# EAGLE schematic xmax_neopixel (EAGLE 9.2.0)
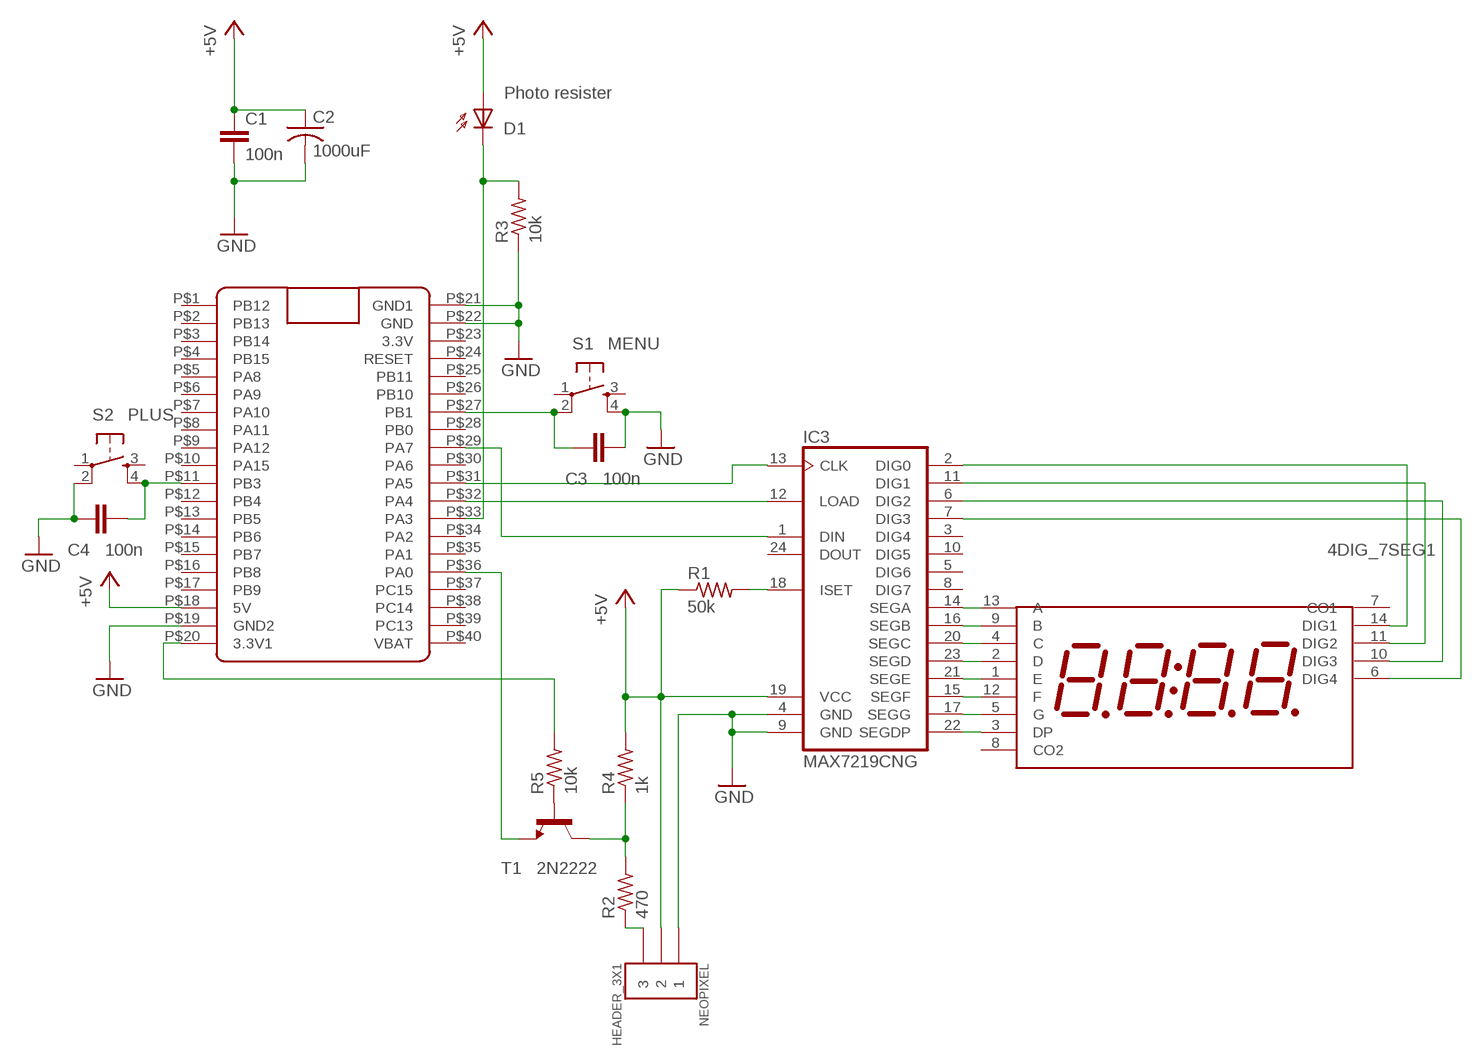
[diagram p0: schematic, sheet 1]

## Parts
4DIG_7SEG1  4DIG_7SEG  [4DIG_7SEG]
C1  100n  C-EU025-024X044  [C025-024X044]
C2  1000uF  C-US025-024X044  [C025-024X044]
C3  100n  C-EU025-024X044  [C025-024X044]
C4  100n  C-EU025-024X044  [C025-024X044]
D1  Photo resister  BPW32  [BPW32]
IC3  MAX7219CNG  [DIL24-3]
NEOPIXEL  HEADER_3X1  [HDRV3W64P254_1X3_762X254X900B_NO_SILK]
R1  50k  R-US_0204/5  [0204/5]
R2  470  R-US_0204/5  [0204/5]
R3  10k  R-US_0204/5  [0204/5]
R4  1k  R-US_0204/5  [0204/5]
R5  10k  R-US_0204/5  [0204/5]
S1  MENU  TAC_SWITCHPTH  [TACTILE-PTH]
S2  PLUS  TAC_SWITCHPTH  [TACTILE-PTH]
T1  2N2222  [TO92-EBC-OVAL]
U$2  BLUE_PILL  [BLUE_PILL]

## Nets
+5V: C1.1 C2.1 D1.A IC3.19(VCC) NEOPIXEL.P$2 R1.1 R4.2 U$2.P$18(5V)
GND: C1.2 C2.2 C3.2 C4.1 IC3.4(GND) IC3.9(GND) NEOPIXEL.P$1 R3.1 S1.4 S2.2 U$2.P$19(GND2) U$2.P$21(GND1) U$2.P$22(GND)
N$1: IC3.13(CLK) U$2.P$31(PA5)
N$2: IC3.12(LOAD) U$2.P$32(PA4)
N$3: IC3.1(DIN) U$2.P$29(PA7)
N$4: IC3.18(ISET) R1.2
N$5: 4DIG_7SEG1.13(A) IC3.14(SEGA)
N$6: T1.E U$2.P$36(PA0)
N$7: 4DIG_7SEG1.9(B) IC3.16(SEGB)
N$8: 4DIG_7SEG1.4(C) IC3.20(SEGC)
N$9: 4DIG_7SEG1.2(D) IC3.23(SEGD)
N$10: 4DIG_7SEG1.1(E) IC3.21(SEGE)
N$11: 4DIG_7SEG1.12(F) IC3.15(SEGF)
N$12: 4DIG_7SEG1.5(G) IC3.17(SEGG)
N$13: 4DIG_7SEG1.3(DP) IC3.22(SEGDP)
N$14: 4DIG_7SEG1.14(DIG1) IC3.2(DIG0)
N$15: 4DIG_7SEG1.11(DIG2) IC3.11(DIG1)
N$16: 4DIG_7SEG1.10(DIG3) IC3.6(DIG2)
N$17: 4DIG_7SEG1.6(DIG4) IC3.7(DIG3)
N$18: NEOPIXEL.P$3 R2.1
N$19: R2.2 R4.1 T1.C
N$20: R5.1 T1.B
N$21: R5.2 U$2.P$20(3.3V1)
N$22: C3.1 S1.2 U$2.P$27(PB1)
N$23: D1.K(C) R3.2 U$2.P$33(PA3)
N$24: C4.2 S2.4 U$2.P$11(PB3)
Unconnected: 4DIG_7SEG1.7(CO1) 4DIG_7SEG1.8(CO2) IC3.3(DIG4) IC3.5(DIG6) IC3.8(DIG7) IC3.10(DIG5) IC3.24(DOUT) S1.1 S1.3 S2.1 S2.3 U$2.P$1(PB12) U$2.P$2(PB13) U$2.P$3(PB14) U$2.P$4(PB15) U$2.P$5(PA8) U$2.P$6(PA9) U$2.P$7(PA10) U$2.P$8(PA11) U$2.P$9(PA12) U$2.P$10(PA15) U$2.P$12(PB4) U$2.P$13(PB5) U$2.P$14(PB6) U$2.P$15(PB7) U$2.P$16(PB8) U$2.P$17(PB9) U$2.P$23(3.3V) U$2.P$24(RESET) U$2.P$25(PB11) U$2.P$26(PB10) U$2.P$28(PB0) U$2.P$30(PA6) U$2.P$34(PA2) U$2.P$35(PA1) U$2.P$37(PC15) U$2.P$38(PC14) U$2.P$39(PC13) U$2.P$40(VBAT)

## Library data of the parts
4DIG_7SEG1 = 7-seg-disp:4DIG_7SEG: This library is modified to the Adafruit 4dig7seg display, part# KW4-56NCBA-P. It doesn't have the up decimal, and the pins are reassigned. This is common cathode. This library was based on BL-Q39A42 respectively BL-Q39B42 display but support many others displays where PAD/PIN assign is same.Display may be common cathode or common anode because PAD/PIN assign is still the same. PIN DESCRIPTION: DIG1-DIG4 : common cathode or common anode of digit CO1-CO2: cathode or anode of colon (Depends on the display), DIG1-DIG4: common cathodes or anodes of digits, A - G+ DP: cathodes or anodes of segments A to F with dot point . Made by: www.developrog.com, modified by Kiki Jewell 2016
C1 C3 C4 = rcl:C-EU: CAPACITOR, European symbol; SPICEPREFIX: C
C2 = rcl:C-US: CAPACITOR, American symbol; SPICEPREFIX: C
D1 = opto-trans-siemens:BPW32: PHOTO DIODE; OC_FARNELL: unknown; OC_NEWARK: unknown
IC3 = maxim:MAX7219CNG: LED DISPLAY DRIVER; MF: MAXIM; MPN: MAX7219CNG; OC_FARNELL: 1523914; OC_NEWARK: 34C4018
NEOPIXEL = Nordic_misc:HEADER_3X1
R1-R5 = rcl:R-US_: RESISTOR, American symbol; SPICEPREFIX: R
S1 S2 = SparkFun-Retired:TAC_SWITCH: Momentary Switch Button commonly used for reset or general input. Spark Fun Electronics SKU : COM-00097 SMT- SWCH-08247
T1 = adafruit:2N2222: NPN TRANSISTOR Big oval pads
U$2 = BluePill:BLUE_PILL